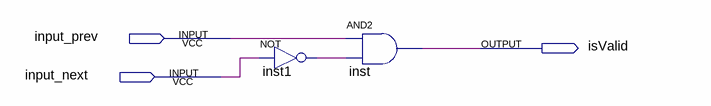
[diagram p0: schematic sheet]
// Quartus schematic input_decoder.bdf as structural Verilog: 2 symbols, 3 pins
module input_decoder (
  input  input_prev,
  input  input_next,
  output isValid
);

  wire inst1_out;

  not inst1 (inst1_out, input_next);
  and inst (isValid, input_prev, inst1_out);
endmodule
